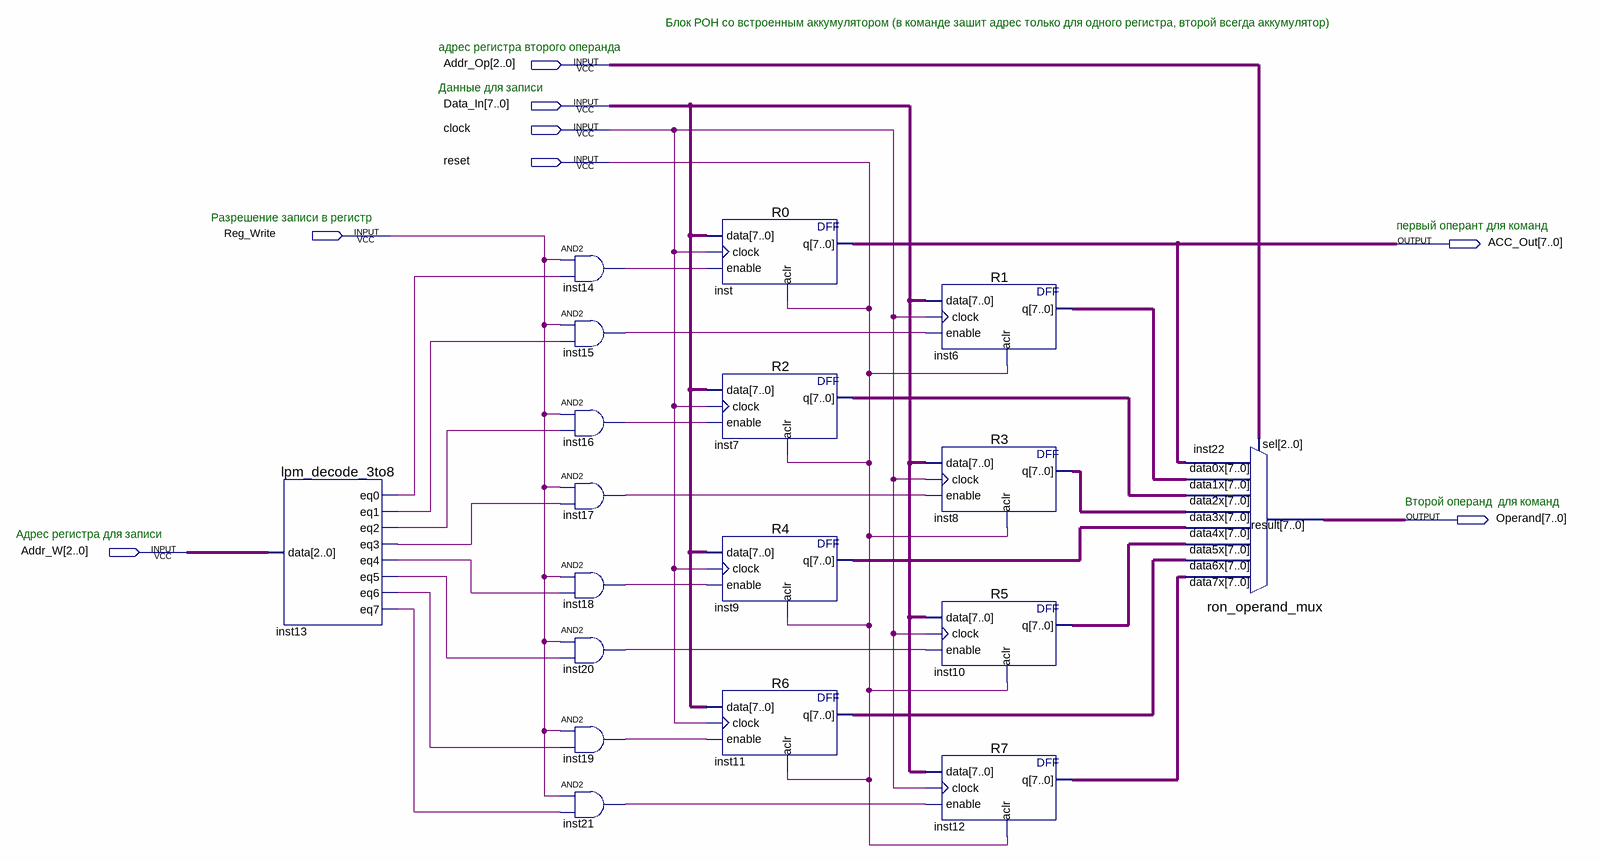
[diagram p0: schematic sheet]
// Quartus schematic alu_POH.bdf as structural Verilog: 18 symbols, 8 pins
module alu_POH (
  input  [2:0] Addr_Op,
  input  [7:0] Data_In,
  input  clock,
  input  reset,
  input  Reg_Write,
  input  [2:0] Addr_W,
  output [7:0] ACC_Out,
  output [7:0] Operand
);

  wire inst13_eq0, inst13_eq1, inst13_eq2, inst13_eq3, inst13_eq4, inst13_eq5, inst13_eq6, inst13_eq7,
       inst14_out, inst15_out, inst16_out, inst17_out, inst18_out, inst19_out, inst20_out, inst21_out;
  wire [7:0] inst6_q, inst7_q, inst8_q, inst9_q, inst10_q, inst11_q, inst12_q;

  lpm_decode_3to8 inst13 (
    .data(Addr_W), .eq0(inst13_eq0), .eq1(inst13_eq1), .eq2(inst13_eq2), .eq3(inst13_eq3), .eq4(inst13_eq4),
    .eq5(inst13_eq5), .eq6(inst13_eq6), .eq7(inst13_eq7));
  and inst14 (inst14_out, Reg_Write, inst13_eq0);
  and inst15 (inst15_out, Reg_Write, inst13_eq1);
  and inst16 (inst16_out, Reg_Write, inst13_eq2);
  and inst17 (inst17_out, Reg_Write, inst13_eq3);
  and inst18 (inst18_out, Reg_Write, inst13_eq4);
  and inst20 (inst20_out, Reg_Write, inst13_eq5);
  and inst19 (inst19_out, Reg_Write, inst13_eq6);
  and inst21 (inst21_out, Reg_Write, inst13_eq7);
  R0 inst (.data(Data_In), .clock(clock), .enable(inst14_out), .aclr(reset), .q(ACC_Out));
  R2 inst7 (.data(Data_In), .clock(clock), .enable(inst16_out), .aclr(reset), .q(inst7_q));
  R4 inst9 (.data(Data_In), .clock(clock), .enable(inst18_out), .aclr(reset), .q(inst9_q));
  R6 inst11 (.data(Data_In), .clock(clock), .enable(inst19_out), .aclr(reset), .q(inst11_q));
  R1 inst6 (.data(Data_In), .clock(clock), .enable(inst15_out), .aclr(reset), .q(inst6_q));
  R3 inst8 (.data(Data_In), .clock(clock), .enable(inst17_out), .aclr(reset), .q(inst8_q));
  R5 inst10 (.data(Data_In), .clock(clock), .enable(inst20_out), .aclr(reset), .q(inst10_q));
  R7 inst12 (.data(Data_In), .clock(clock), .enable(inst21_out), .aclr(reset), .q(inst12_q));
  ron_operand_mux inst22 (
    .data7x(inst12_q), .data6x(inst11_q), .data5x(inst10_q), .data4x(inst9_q), .data3x(inst8_q),
    .data2x(inst7_q), .data1x(inst6_q), .data0x(ACC_Out), .sel(Addr_Op), .result(Operand));

  // Notes on the sheet:
  //   Блок РОН со встроенным аккумулятором (в команде зашит адрес только для одного регистра, второй всегда аккумулятор)
  //   адрес регистра второго операнда
  //   Данные для записи
  //   Разрешение записи в регистр
  //   первый оперант для команд
  //   Второй операнд  для команд
  //   Адрес регистра для записи
endmodule
